# Altium project ALF.PrjPcb
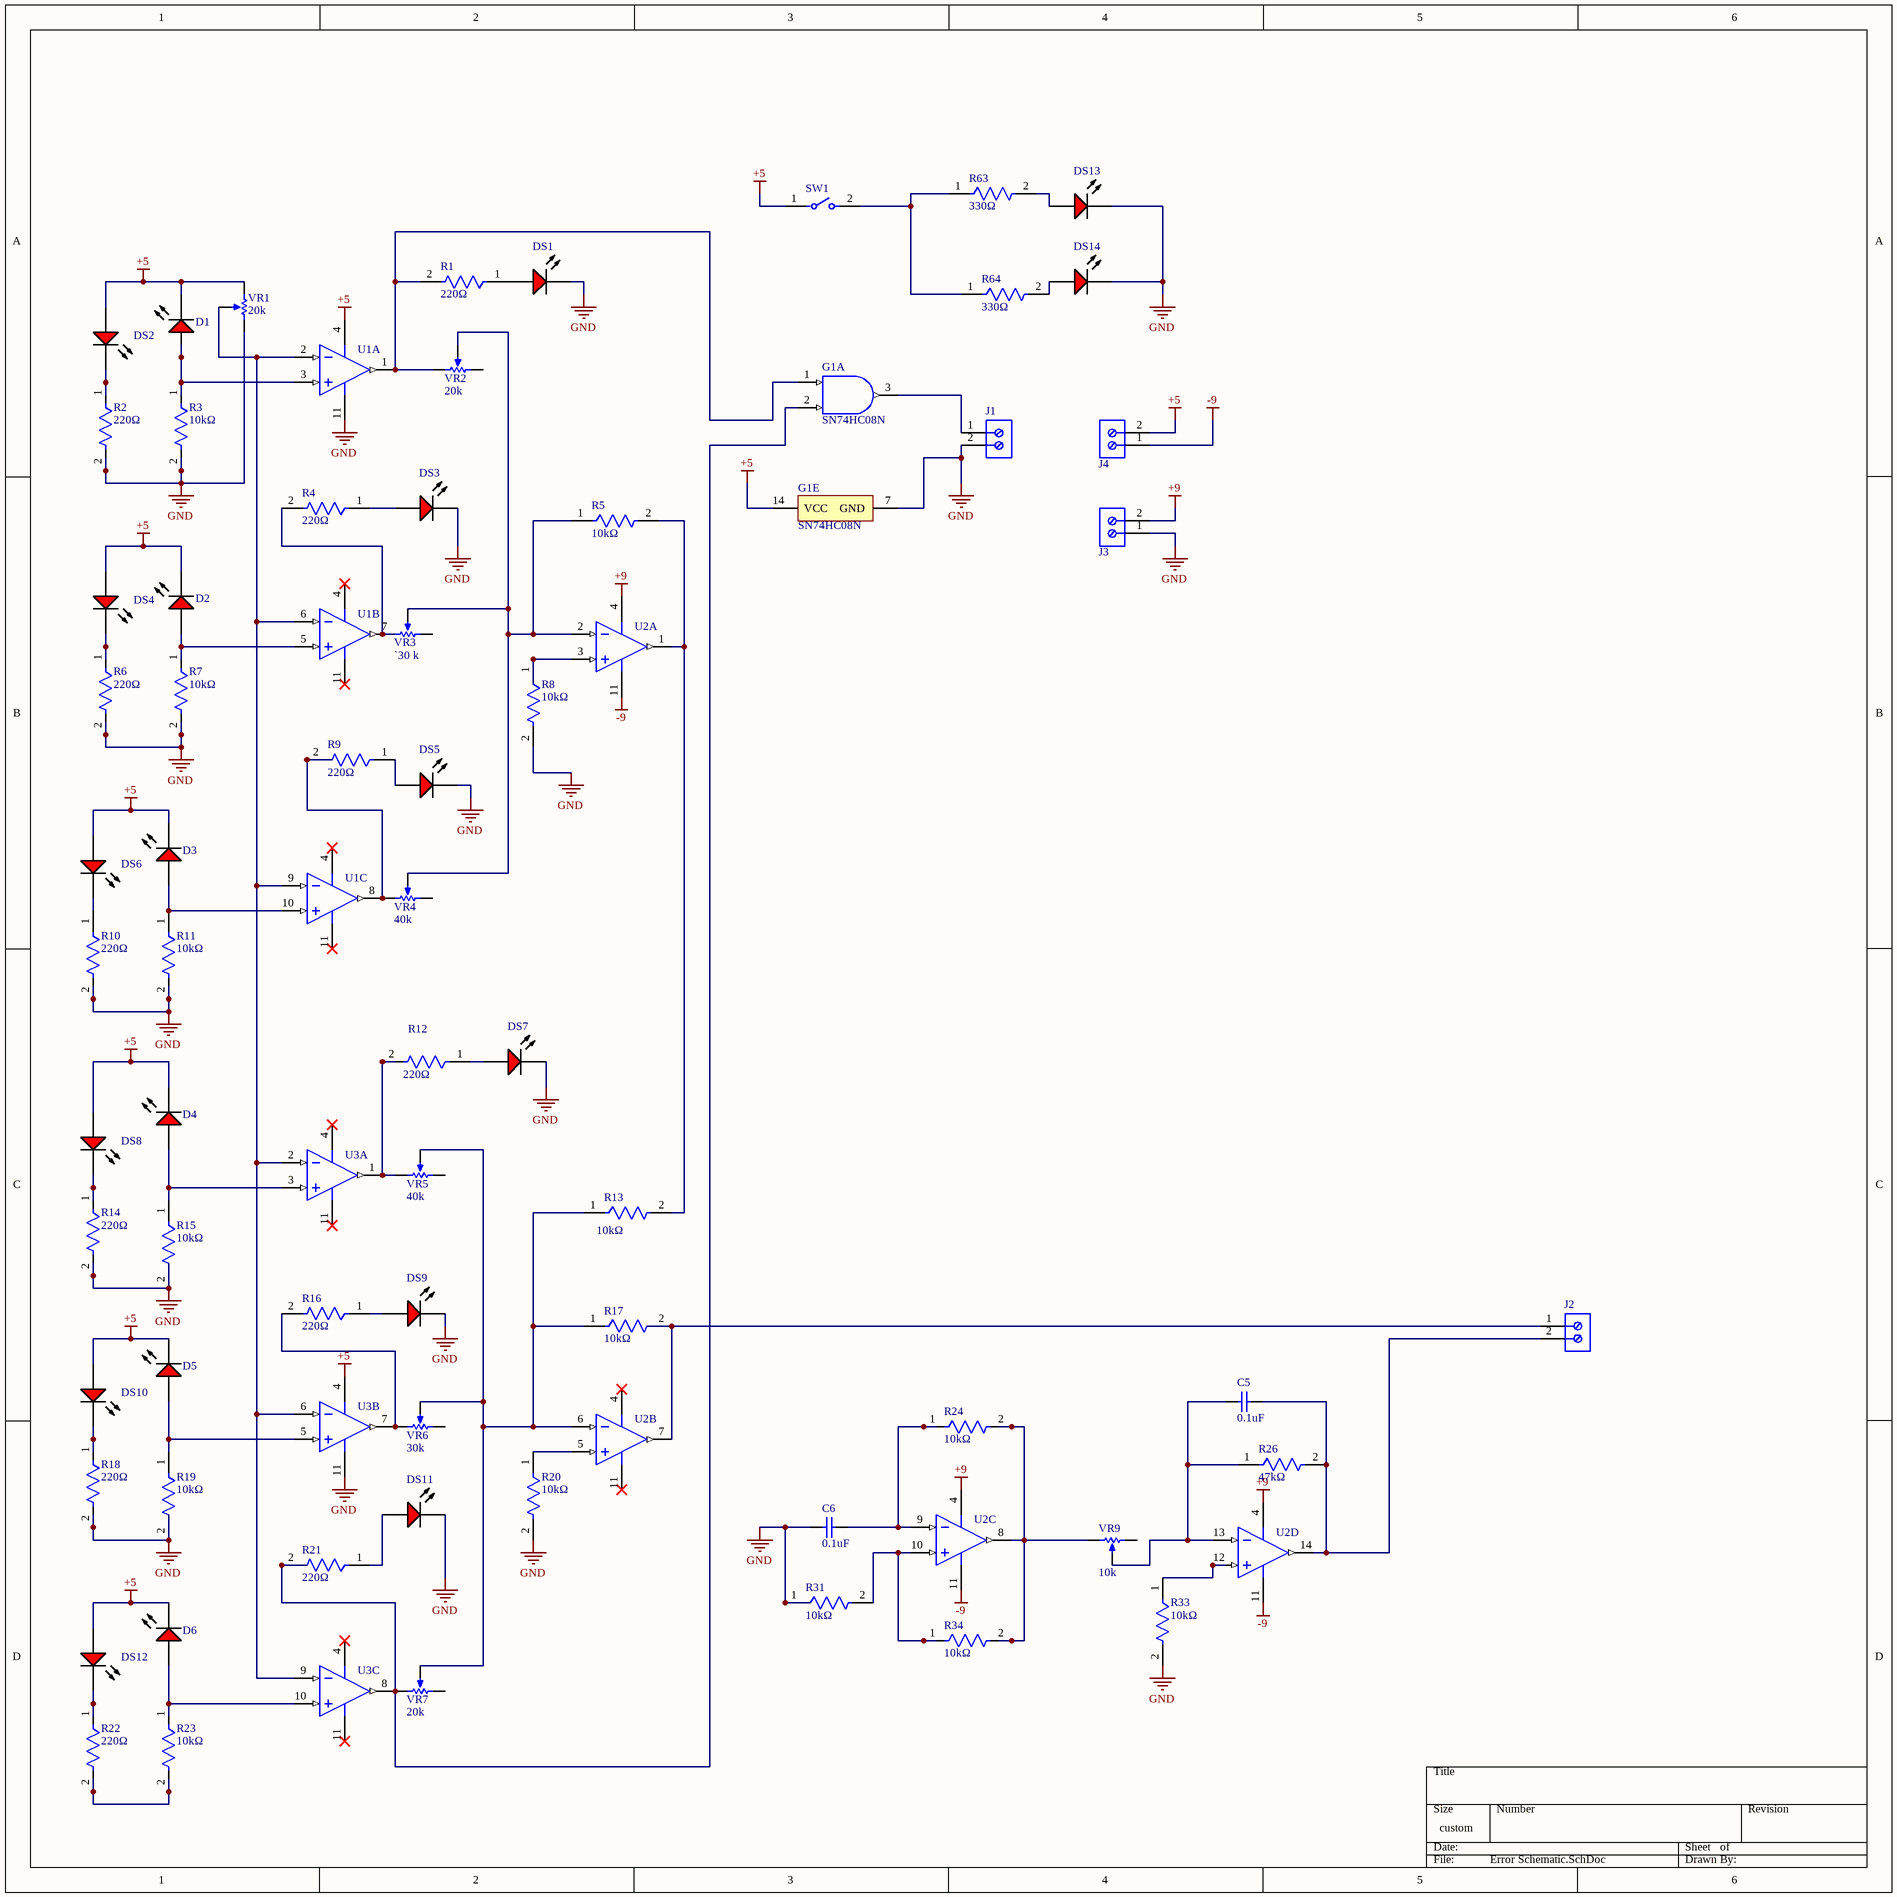
[diagram p0: Error Schematic.SchDoc]
2 sheets, 124 parts. Net scope: global (net labels, ports and power ports of the same name join across sheets).
Board files: ErrorPCB.PcbDoc, PIDPCB.PcbDoc
Sheets:
  Error Schematic.SchDoc
  PID Schematic.SchDoc

## Sheet Error Schematic.SchDoc
size 381 x 381 mm

### Parts
C5  value 0.1uF  [CAPR51-254-508X318X736]  (hidden comment: C320C104K5R5TA)
C6  value 0.1uF  [CAPR51-254-508X318X736]  (hidden comment: C320C104K5R5TA)
D1  HLMP-3301  [AVAG-HLMP-3301-2]  (value not drawn)
D2  HLMP-3301  [AVAG-HLMP-3301-2]  (value not drawn)
D3  HLMP-3301  [AVAG-HLMP-3301-2]  (value not drawn)
D4  HLMP-3301  [AVAG-HLMP-3301-2]  (value not drawn)
D5  HLMP-3301  [AVAG-HLMP-3301-2]  (value not drawn)
D6  HLMP-3301  [AVAG-HLMP-3301-2]  (value not drawn)
DS1  HLMP-3301  [AVAG-HLMP-3301-2]  (value not drawn)
DS2  HLMP-3301  [AVAG-HLMP-3301-2]  (value not drawn)
DS3  HLMP-3301  [AVAG-HLMP-3301-2]  (value not drawn)
DS4  HLMP-3301  [AVAG-HLMP-3301-2]  (value not drawn)
DS5  HLMP-3301  [AVAG-HLMP-3301-2]  (value not drawn)
DS6  HLMP-3301  [AVAG-HLMP-3301-2]  (value not drawn)
DS7  HLMP-3301  [AVAG-HLMP-3301-2]  (value not drawn)
DS8  HLMP-3301  [AVAG-HLMP-3301-2]  (value not drawn)
DS9  HLMP-3301  [AVAG-HLMP-3301-2]  (value not drawn)
DS10  HLMP-3301  [AVAG-HLMP-3301-2]  (value not drawn)
DS11  HLMP-3301  [AVAG-HLMP-3301-2]  (value not drawn)
DS12  HLMP-3301  [AVAG-HLMP-3301-2]  (value not drawn)
DS13  HLMP-3301  [AVAG-HLMP-3301-2]  (value not drawn)
DS14  HLMP-3301  [AVAG-HLMP-3301-2]  (value not drawn)
G1  SN74HC08N  [N0014A]  (parts A,E of 5)
J1  691103110002  [691103110002]  (value not drawn)
J2  691103110002  [691103110002]  (value not drawn)
J3  691103110002  [691103110002]  (value not drawn)
J4  691103110002  [691103110002]  (value not drawn)
R1  Resistance: 220Ω  [FP-MRS25-MFG]  (hidden comment: MRS25000C1101FCT00)
R2  Resistance: 220Ω  [FP-MRS25-MFG]  (hidden comment: MRS25000C1101FCT00)
R3  Resistance: 10kΩ  [FP-MRS25-MFG]  (hidden comment: MRS25000C1101FCT00)
R4  Resistance: 220Ω  [FP-MRS25-MFG]  (hidden comment: MRS25000C1101FCT00)
R5  Resistance: 10kΩ  [FP-MRS25-MFG]  (hidden comment: MRS25000C1101FCT00)
R6  Resistance: 220Ω  [FP-MRS25-MFG]  (hidden comment: MRS25000C1101FCT00)
R7  Resistance: 10kΩ  [FP-MRS25-MFG]  (hidden comment: MRS25000C1101FCT00)
R8  Resistance: 10kΩ  [FP-MRS25-MFG]  (hidden comment: MRS25000C1101FCT00)
R9  Resistance: 220Ω  [FP-MRS25-MFG]  (hidden comment: MRS25000C1101FCT00)
R10  Resistance: 220Ω  [FP-MRS25-MFG]  (hidden comment: MRS25000C1101FCT00)
R11  Resistance: 10kΩ  [FP-MRS25-MFG]  (hidden comment: MRS25000C1101FCT00)
R12  Resistance: 220Ω  [FP-MRS25-MFG]  (hidden comment: MRS25000C1101FCT00)
R13  Resistance: 10kΩ  [FP-MRS25-MFG]  (hidden comment: MRS25000C1101FCT00)
R14  Resistance: 220Ω  [FP-MRS25-MFG]  (hidden comment: MRS25000C1101FCT00)
R15  Resistance: 10kΩ  [FP-MRS25-MFG]  (hidden comment: MRS25000C1101FCT00)
R16  Resistance: 220Ω  [FP-MRS25-MFG]  (hidden comment: MRS25000C1101FCT00)
R17  Resistance: 10kΩ  [FP-MRS25-MFG]  (hidden comment: MRS25000C1101FCT00)
R18  Resistance: 220Ω  [FP-MRS25-MFG]  (hidden comment: MRS25000C1101FCT00)
R19  Resistance: 10kΩ  [FP-MRS25-MFG]  (hidden comment: MRS25000C1101FCT00)
R20  Resistance: 10kΩ  [FP-MRS25-MFG]  (hidden comment: MRS25000C1101FCT00)
R21  Resistance: 220Ω  [FP-MRS25-MFG]  (hidden comment: MRS25000C1101FCT00)
R22  Resistance: 220Ω  [FP-MRS25-MFG]  (hidden comment: MRS25000C1101FCT00)
R23  Resistance: 10kΩ  [FP-MRS25-MFG]  (hidden comment: MRS25000C1101FCT00)
R24  Resistance: 10kΩ  [FP-MRS25-MFG]  (hidden comment: MRS25000C1101FCT00)
R26  Resistance: 47kΩ  [FP-MRS25-MFG]  (hidden comment: MRS25000C1101FCT00)
R31  Resistance: 10kΩ  [FP-MRS25-MFG]  (hidden comment: MRS25000C1101FCT00)
R33  Resistance: 10kΩ  [FP-MRS25-MFG]  (hidden comment: MRS25000C1101FCT00)
R34  Resistance: 10kΩ  [FP-MRS25-MFG]  (hidden comment: MRS25000C1101FCT00)
R63  Resistance: 330Ω  [FP-MRS25-MFG]  (hidden comment: MRS25000C1101FCT00)
R64  Resistance: 330Ω  [FP-MRS25-MFG]  (hidden comment: MRS25000C1101FCT00)
SW1  BD01  [FP-BD01-MFG]  (value not drawn)
U1  LM324N  [N0014A]  (value not drawn)  (parts A,B,C of 4)
U2  LM324N  [N0014A]  (value not drawn)  (parts A,B,C,D of 4)
U3  LM324N  [N0014A]  (value not drawn)  (parts A,B,C of 4)
VR1  Resistance: 20k  [BOUR-3296W]  (hidden comment: 3296W-1-103LF)
VR2  Resistance: 20k  [BOUR-3296W]  (hidden comment: 3296W-1-103LF)
VR3  Resistance: `30 k  [BOUR-3296W]  (hidden comment: 3296W-1-103LF)
VR4  Resistance: 40k  [BOUR-3296W]  (hidden comment: 3296W-1-103LF)
VR5  Resistance: 40k  [BOUR-3296W]  (hidden comment: 3296W-1-103LF)
VR6  Resistance: 30k  [BOUR-3296W]  (hidden comment: 3296W-1-103LF)
VR7  Resistance: 20k  [BOUR-3296W]  (hidden comment: 3296W-1-103LF)
VR9  Resistance: 10k  [BOUR-3296W]  (hidden comment: 3296W-1-103LF)

### Nets
+5: D1.1(K) D2.1(K) D3.1(K) D4.1(K) D5.1(K) D6.1(K) DS2.2(A) DS4.2(A) DS6.2(A) DS8.2(A) DS10.2(A) DS12.2(A) G1.14(VCC) J4.2 SW1.1 U1.4(V+) U3.4(V+) VR1.1(CCW)
+9: J3.2 U2.4(V+)
-9: J4.1 U2.11(GND)
GND: C6.1 DS1.1(K) DS3.1(K) DS5.1(K) DS7.1(K) DS9.1(K) DS11.1(K) DS13.1(K) DS14.1(K) G1.7(GND) J1.2 J3.1 R2.2 R3.2 R6.2 R7.2 R8.2 R10.2 R11.2 R14.2 R15.2 R18.2 R19.2 R20.2 R31.1 R33.2 U1.11(GND) U3.11(GND) VR1.3(CW)
NetC5_1: C5.1 R26.1 U2.13(IN4-) VR9.2(S)
NetC5_2: C5.2 J2.2 R26.2 U2.14(OUT4)
NetC6_2: C6.2 R24.1 U2.9(IN3-)
NetD1_2: D1.2(A) R3.1 U1.3(IN1+)
NetD2_2: D2.2(A) R7.1 U1.5(IN2+)
NetD3_2: D3.2(A) R11.1 U1.10(IN3+)
NetD4_2: D4.2(A) R15.1 U3.3(IN1+)
NetD5_2: D5.2(A) R19.1 U3.5(IN2+)
NetD6_2: D6.2(A) R23.1 U3.10(IN3+)
NetDS1_2: DS1.2(A) R1.1
NetDS2_1: DS2.1(K) R2.1
NetDS3_2: DS3.2(A) R4.1
NetDS4_1: DS4.1(K) R6.1
NetDS5_2: DS5.2(A) R9.1
NetDS6_1: DS6.1(K) R10.1
NetDS7_2: DS7.2(A) R12.1
NetDS8_1: DS8.1(K) R14.1
NetDS9_2: DS9.2(A) R16.1
NetDS10_1: DS10.1(K) R18.1
NetDS11_2: DS11.2(A) R21.1
NetDS12_1: DS12.1(K) R22.1
NetDS13_2: DS13.2(A) R63.2
NetDS14_2: DS14.2(A) R64.2
NetG1_1: G1.1(1A) R1.2 U1.1(OUT1) VR2.3(CW)
NetG1_2: G1.2(1B) R21.2 U3.8(OUT3) VR7.3(CW)
NetG1_3: G1.3(1Y) J1.1
NetJ2_1: J2.1 R17.2 U2.7(OUT2)
NetR4_2: R4.2 U1.7(OUT2) VR3.3(CW)
NetR5_1: R5.1 U2.2(IN1-) VR2.2(S) VR3.2(S) VR4.2(S)
NetR5_2: R5.2 R13.2 U2.1(OUT1)
NetR8_1: R8.1 U2.3(IN1+)
NetR9_2: R9.2 U1.8(OUT3) VR4.3(CW)
NetR12_2: R12.2 U3.1(OUT1) VR5.3(CW)
NetR13_1: R13.1 R17.1 U2.6(IN2-) VR5.2(S) VR6.2(S) VR7.2(S)
NetR16_2: R16.2 U3.7(OUT2) VR6.3(CW)
NetR20_1: R20.1 U2.5(IN2+)
NetR22_2: R22.2 R23.2
NetR24_2: R24.2 R34.2 U2.8(OUT3) VR9.1(CCW)
NetR31_2: R31.2 R34.1 U2.10(IN3+)
NetR33_1: R33.1 U2.12(IN4+)
NetR63_1: R63.1 R64.1 SW1.2
NetU1_2: U1.2(IN1-) U1.6(IN2-) U1.9(IN3-) U3.2(IN1-) U3.6(IN2-) U3.9(IN3-) VR1.2(S)

Not connected (* = marked no-connect by the designer): VR2 1(CCW); VR3 1(CCW); VR4 1(CCW); VR5 1(CCW); VR6 1(CCW); VR7 1(CCW); VR9 3(CW)

### Library data of the parts
C5 C6 = CMP-1664-00004-1: Radial Leaded Multilayer Ceramic Capacitor, 0.1 uF, +/- 10%, 50 V, -55 to 125 degC, 2-Pin THD, RoHS, Tape and Reel; Case\Package: SOT-23-5; Max Power Dissipation: 250 mW; Output Current: 150 mA; Dropout Voltage: 260 mV; Outputs: 1; Output Voltage: 5 V; Max Input Voltage: 8 V; Min Operating Temperature: -40 degC; Packaging: Tape and Reel; Height: 1.3 mm; Radiation Hardening: No; Pins: 5; ComponentLink1Description: Manufacturer URL; Mount: Surface Mount; RoHSCompliant: true; Max Operating Temperature: 85 degC; PackageReference: CAPR51-254-508X318X736; ComponentLink2URL: http://www.kemet.com/docfinder?Partnumber=C320C104K5R5TA; PackageDescription: 2-Pin Through Hole Device, Body 5.08 x 3.18 mm, Pitch 2.54 mm; ComponentLink1URL: http://www.kemet.com/; Width: 1.8 mm; Package Quantity: 3000; DatasheetVersion: Dec-15; Length: 3 mm; ComponentLink2Description: Datasheet
D1-D6 DS1-DS14 = CMP-2000-06411-1: T-1 3/4 (5 mm) Diffused LED Lamp, 1.9 V, -40 to 100 degC, 2-Pin THD, RoHS, Bulk; Manufacturer: Avago; Forward Current: 25mA; Forward Voltage: 2.4V; Peak Wavelength: 635nm; Shape Type: Circular; High Brightness: No; Main Category: StandardLED; Test Current (It): 10mA; Dominant Wave Length: 626nm; Number of  Elements: 1; Reverse Voltage: 5V; Chip Material: GaP; Product Height (mm): 9.19mm; Lens Type: ColoredDiffused; Viewing Angle: 60deg; Type: Uni-Color; Emitting Color: Red; Luminous Intensity: 5.4mcd; Power Dissipation: 85W; DELETED: Compliant; Product Depth (mm): 6.1mm; Package Description: 2-Pin Through Hole LED, Dia 5.85 mm; Mounting Technology: ThroughHole; Manufacturer URL: http://www.avagotech.com/; Package Type: T-13/4; Operating Temp Range: -40Cto100C; Datasheet URL: http://www.avagotech.com/docs/AV02-1558EN; Mounting: ThroughHole; Lens Dimensions: 5.08x5.08x8.3mm; Package Reference: HLMP-3301; Datasheet Version: 03/2015; Pin Count: 2; Packaging: TapeandReel; Operating Temperature Classification: Industrial; Lum Intensity: 5.4mcd; Rad Hardened: No; Product Length (mm): 6.1mm
G1 = CMP-0777-00250-3: Quadruple 2-Input Positive-AND Gates, N0014A, TUBE; Manufacturer: Texas Instruments; Output Type: CMOS; ICC @ Nom Voltage(Max)(mA): 0.02; tpd @ Nom Voltage(Max)(ns): 28; Voltage(Nom)(V): 5; VCC(Min)(V): 2; Technology Family: HC; F @ Nom Voltage(Max)(Mhz): 70; Rating: Catalog; Bits(#): 4; Schmitt Trigger: No; VCC(Max)(V): 6; PackageReference: N0014A; Input Type: CMOS; Generic Part Number: SN74HC08; DatasheetVersion: SCLS081F; Operating Temperature Range(C): -40 to 85
J1-J4 = CMP-1502-03254-1: Series 1031 - 3.50 mm Horizontal Entry Modular with Pressure Clamp WR-TBL, 2 pin; Manufacturer: Wurth Elektronik; Pin Number: 2; Pitch: 3.50mm; Datasheet URL: http://katalog.we-online.de/em/datasheet/6911031100xx.pdf; Package Reference: 691103110002; Publisher: WurthElektronik; Manufacturer URL: http://www.we-online.de; Mounting Technology: THT; Operating Temperature: -40to105degC; Part Number: 691103110002; Packaging: Box
R1-R24 R26 R31 R33 R34 R63 R64 = CMP-02408-000003-1: RES 1.1K OHM 0.6W 1% AXIAL; Manufacturer: Vishay BC Components; Voltage Rating: 350V; Temperature Coefficient: 50ppm/°C; Value: 1.1kΩ; Device Class L1: Passive Components; Height: 2.5mm; Octopart: https://octopart.com/mrs25000c1101fct00-vishay-43740214; Temperature Range Low: -55°C; Temperature: -55°C to +155°C; Temperature Range High: +155°C; Lead Free: Yes; Mouser Description: Thin Film Resistors .6watt 1.1Kohms 1%; Power Rating: 0.6W; Digikey Description: RES 1.1K OHM 0.6W 1% AXIAL; RoHS: TRUE; Tolerance: 1%; Package: MRS25; Device Class L3: Through-Hole Resistors; ComponentLink2URL: http://www.vishay.com/docs/28724/mrs16m25.pdf; ComponentLink2Description: Datasheet; Composition: Thin Film; Automotive: No; Ipc Land Pattern Name: RESAD1000W75L650D250; Device Class L2: Resistors; Category: Res; Series: MRS25; Manufacturer Part Number: MRS25000C1101FCT00
SW1 = CMP-10033-000004-1: SWITCH SLIDE DIP SPST 100MA 5V; Max Voltage Rating (DC): 25V; Contact Current Rating: 25mA; Pitch: 0.1inch; Number of Circuits: 1; Actuator Material: Nylon; Life (Cycles): 10000Cycles; Body Material: PBT; Approvals: UL; Actuator Type: Slide (Standard); Washable: Yes; Actuator Length: 0.9mm; Capacitance: 5pF; Length: 0.18inch; Lead Free: Lead Free; Material: Nylon; Termination: PC Pin; Orientation: Straight; Throw Configuration: SPST; Case/Package: DIP; Package Quantity: 115; Packaging: Rail/Tube; Number of Positions: 1; Max Operating Temperature: 85°C; Terminal Pitch: 2.54mm; Mount: Through Hole; Min Operating Temperature: -40°C; RoHS Compliant: Yes; Depth: 9.65mm; Electrical Life: 10000Cycles; Series: BD; Contact Material: Bronze; Max Current Rating: 100mA; Current Rating: 100mA; Mechanical Life: 10000Cycles; Number of Poles: 1; REACH SVHC: No SVHC; Contact Plating: Gold; Radiation Hardening: No; Width: 9.65mm; Voltage Rating (DC): 5V
U1-U3 = CMP-0055-00082-3: Low Power Quad Operational Amplifier, 14-pin MDIP; Manufacturer: Texas Instruments; CompType: Amplifiers; PowerWise: N; PackageTopMarking: NSUZXYYTTE#*LM324N; PackageDescription: MDIP, .750 x .250 x.130in, 14 Lead, .100in Pitch; Package Reference: N0014A; RoHS: N; Code_JEDEC: MS-001-AA; ComponentLink1URL: http://www.ti.com/general/docs/lit/getliterature.tsp?genericPartNumber=LM324&fileType=pdf; ComponentLink1Description: Datasheet URL; PinCount: 14
VR1-VR7 VR9 = CMP-1747-00001-1: Square Trimpot(R) Trimming Potentiometer, 10 KOhm, +/- 10%, 0.5 W, -55 to 125 degC, 3-Pin THD, RoHS, Tube; Voltage Rating: 75 V; Tolerance: 1%; Power Rating: 100 mW; Case\Package: 0603; Type (Resistor): Thick Film; PackageDescription: 3-Pin Through Hole Device, Body 9.53 x 4.83 mm, Pitch 2.54 mm; RoHSCompliant: true; Package Quantity: 5000; Case Code (Metric): 1608; PackageReference: 3296W; ComponentLink2Description: Datasheet; REACH SVHC: Unknown; Case Code (Imperial): 0603; ComponentLink1URL: http://www.bourns.com/; Width: 0.85 mm; Radiation Hardening: No; Min Operating Temperature: -55 degC; Mount: Surface Mount; ComponentLink1Description: Manufacturer URL; Max Operating Temperature: 155 degC; Weight: 7.1E-05 oz; Pins: 2; DatasheetVersion: May-16; Packaging: Tape and Reel; Height: 0.45 mm; Length: 1.55 mm; ComponentLink2URL: http://www.bourns.com/docs/Product-Datasheets/3296.pdf

## Sheet PID Schematic.SchDoc
size 508 x 304 mm
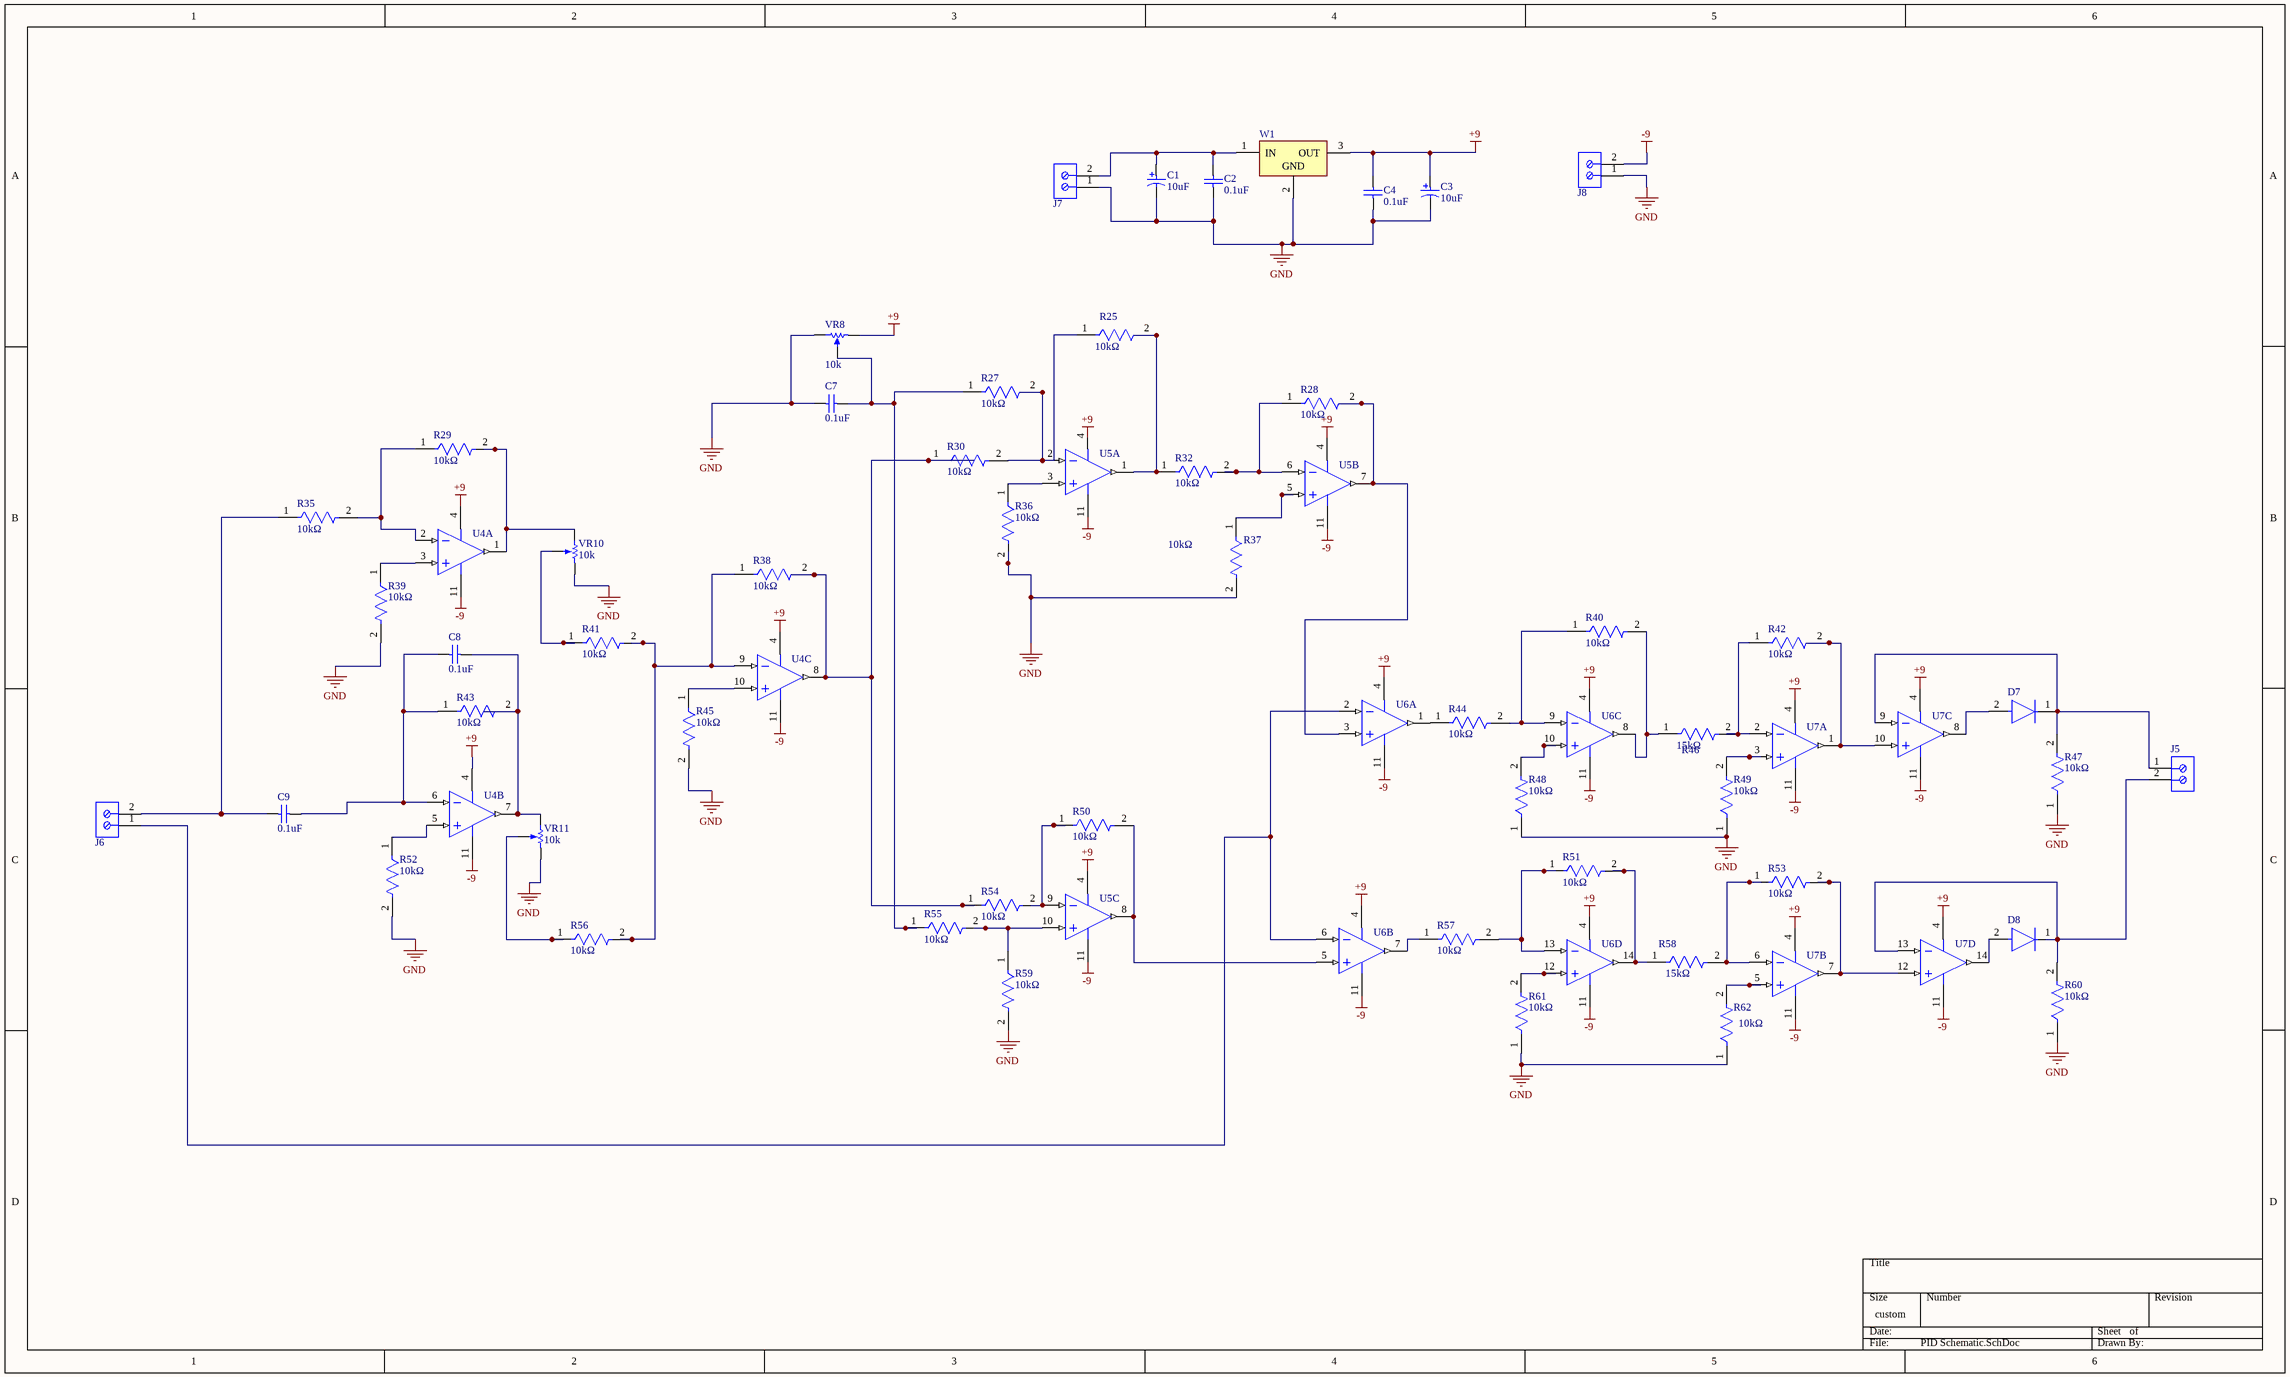
[diagram p1: PID Schematic.SchDoc]

### Parts
C1  Capacitance: 10uF  [CAPPR55-200-1100X500X1200]  (hidden comment: ECA1HM100)
C2  value 0.1uF  [CAPR51-254-508X318X736]  (hidden comment: C320C104K5R5TA)
C3  Capacitance: 10uF  [CAPPR55-200-1100X500X1200]  (hidden comment: ECA1HM100)
C4  value 0.1uF  [CAPR51-254-508X318X736]  (hidden comment: C320C104K5R5TA)
C7  value 0.1uF  [CAPR51-254-508X318X736]  (hidden comment: C320C104K5R5TA)
C8  value 0.1uF  [CAPR51-254-508X318X736]  (hidden comment: C320C104K5R5TA)
C9  value 0.1uF  [CAPR51-254-508X318X736]  (hidden comment: C320C104K5R5TA)
D7  1N4148  [FP-017AG-MFG]  (value not drawn)
D8  1N4148  [FP-017AG-MFG]  (value not drawn)
J5  691103110002  [691103110002]  (value not drawn)
J6  691103110002  [691103110002]  (value not drawn)
J7  691103110002  [691103110002]  (value not drawn)
J8  691103110002  [691103110002]  (value not drawn)
R25  Resistance: 10kΩ  [FP-MRS25-MFG]  (hidden comment: MRS25000C1101FCT00)
R27  Resistance: 10kΩ  [FP-MRS25-MFG]  (hidden comment: MRS25000C1101FCT00)
R28  Resistance: 10kΩ  [FP-MRS25-MFG]  (hidden comment: MRS25000C1101FCT00)
R29  Resistance: 10kΩ  [FP-MRS25-MFG]  (hidden comment: MRS25000C1101FCT00)
R30  Resistance: 10kΩ  [FP-MRS25-MFG]  (hidden comment: MRS25000C1101FCT00)
R32  Resistance: 10kΩ  [FP-MRS25-MFG]  (hidden comment: MRS25000C1101FCT00)
R35  Resistance: 10kΩ  [FP-MRS25-MFG]  (hidden comment: MRS25000C1101FCT00)
R36  Resistance: 10kΩ  [FP-MRS25-MFG]  (hidden comment: MRS25000C1101FCT00)
R37  Resistance: 10kΩ  [FP-MRS25-MFG]  (hidden comment: MRS25000C1101FCT00)
R38  Resistance: 10kΩ  [FP-MRS25-MFG]  (hidden comment: MRS25000C1101FCT00)
R39  Resistance: 10kΩ  [FP-MRS25-MFG]  (hidden comment: MRS25000C1101FCT00)
R40  Resistance: 10kΩ  [FP-MRS25-MFG]  (hidden comment: MRS25000C1101FCT00)
R41  Resistance: 10kΩ  [FP-MRS25-MFG]  (hidden comment: MRS25000C1101FCT00)
R42  Resistance: 10kΩ  [FP-MRS25-MFG]  (hidden comment: MRS25000C1101FCT00)
R43  Resistance: 10kΩ  [FP-MRS25-MFG]  (hidden comment: MRS25000C1101FCT00)
R44  Resistance: 10kΩ  [FP-MRS25-MFG]  (hidden comment: MRS25000C1101FCT00)
R45  Resistance: 10kΩ  [FP-MRS25-MFG]  (hidden comment: MRS25000C1101FCT00)
R46  Resistance: 15kΩ  [FP-MRS25-MFG]  (hidden comment: MRS25000C1101FCT00)
R47  Resistance: 10kΩ  [FP-MRS25-MFG]  (hidden comment: MRS25000C1101FCT00)
R48  Resistance: 10kΩ  [FP-MRS25-MFG]  (hidden comment: MRS25000C1101FCT00)
R49  Resistance: 10kΩ  [FP-MRS25-MFG]  (hidden comment: MRS25000C1101FCT00)
R50  Resistance: 10kΩ  [FP-MRS25-MFG]  (hidden comment: MRS25000C1101FCT00)
R51  Resistance: 10kΩ  [FP-MRS25-MFG]  (hidden comment: MRS25000C1101FCT00)
R52  Resistance: 10kΩ  [FP-MRS25-MFG]  (hidden comment: MRS25000C1101FCT00)
R53  Resistance: 10kΩ  [FP-MRS25-MFG]  (hidden comment: MRS25000C1101FCT00)
R54  Resistance: 10kΩ  [FP-MRS25-MFG]  (hidden comment: MRS25000C1101FCT00)
R55  Resistance: 10kΩ  [FP-MRS25-MFG]  (hidden comment: MRS25000C1101FCT00)
R56  Resistance: 10kΩ  [FP-MRS25-MFG]  (hidden comment: MRS25000C1101FCT00)
R57  Resistance: 10kΩ  [FP-MRS25-MFG]  (hidden comment: MRS25000C1101FCT00)
R58  Resistance: 15kΩ  [FP-MRS25-MFG]  (hidden comment: MRS25000C1101FCT00)
R59  Resistance: 10kΩ  [FP-MRS25-MFG]  (hidden comment: MRS25000C1101FCT00)
R60  Resistance: 10kΩ  [FP-MRS25-MFG]  (hidden comment: MRS25000C1101FCT00)
R61  Resistance: 10kΩ  [FP-MRS25-MFG]  (hidden comment: MRS25000C1101FCT00)
R62  Resistance: 10kΩ  [FP-MRS25-MFG]  (hidden comment: MRS25000C1101FCT00)
U4  LM324N  [N0014A]  (value not drawn)  (parts A,B,C of 4)
U5  LM324N  [N0014A]  (value not drawn)  (parts A,B,C of 4)
U6  LM324N  [N0014A]  (value not drawn)  (parts A,B,C,D of 4)
U7  LM324N  [N0014A]  (value not drawn)  (parts A,B,C,D of 4)
VR8  Resistance: 10k  [BOUR-3296W]  (hidden comment: 3296W-1-103LF)
VR10  Resistance: 10k  [BOUR-3296W]  (hidden comment: 3296W-1-103LF)
VR11  Resistance: 10k  [BOUR-3296W]  (hidden comment: 3296W-1-103LF)
W1  L7809CV  [TO220]  (value not drawn)

### Nets
+9: C3.1 C4.1 U4.4(V+) U5.4(V+) U6.4(V+) U7.4(V+) VR8.3(CW) W1.3(OUT)
-9: J8.2 U4.11(GND) U5.11(GND) U6.11(GND) U7.11(GND)
GND: C1.2 C2.2 C3.2 C4.2 C7.1 J7.1 J8.1 R36.2 R37.2 R39.2 R45.2 R47.1 R48.1 R49.1 R52.2 R59.2 R60.1 R61.1 R62.1 VR8.1(CCW) VR10.3(CW) VR11.3(CW) W1.2(GND)
NetC1_1: C1.1 C2.1 J7.2 W1.1(IN)
NetC7_2: C7.2 R27.1 R55.1 VR8.2(S)
NetC8_1: C8.1 C9.2 R43.1 U4.6(IN2-)
NetC8_2: C8.2 R43.2 U4.7(OUT2) VR11.1(CCW)
NetC9_1: C9.1 J6.2 R35.1
NetD7_1: D7.1(C) J5.1 R47.2 U7.9(IN3-)
NetD7_2: D7.2(A) U7.8(OUT3)
NetD8_1: D8.1(C) J5.2 R60.2 U7.13(IN4-)
NetD8_2: D8.2(A) U7.14(OUT4)
NetJ6_1: J6.1 U6.2(IN1-) U6.6(IN2-)
NetR25_1: R25.1 R27.2 R30.2 U5.2(IN1-)
NetR25_2: R25.2 R32.1 U5.1(OUT1)
NetR28_1: R28.1 R32.2 U5.6(IN2-)
NetR28_2: R28.2 U5.7(OUT2) U6.3(IN1+)
NetR29_1: R29.1 R35.2 U4.2(IN1-)
NetR29_2: R29.2 U4.1(OUT1) VR10.1(CCW)
NetR30_1: R30.1 R38.2 R54.1 U4.8(OUT3)
NetR36_1: R36.1 U5.3(IN1+)
NetR37_1: R37.1 U5.5(IN2+)
NetR38_1: R38.1 R41.2 R56.2 U4.9(IN3-)
NetR39_1: R39.1 U4.3(IN1+)
NetR40_1: R40.1 R44.2 U6.9(IN3-)
NetR40_2: R40.2 R46.1 U6.8(OUT3)
NetR41_1: R41.1 VR10.2(S)
NetR42_1: R42.1 R46.2 U7.2(IN1-)
NetR42_2: R42.2 U7.1(OUT1) U7.10(IN3+)
NetR44_1: R44.1 U6.1(OUT1)
NetR45_1: R45.1 U4.10(IN3+)
NetR48_2: R48.2 U6.10(IN3+)
NetR49_2: R49.2 U7.3(IN1+)
NetR50_1: R50.1 R54.2 U5.9(IN3-)
NetR50_2: R50.2 U5.8(OUT3) U6.5(IN2+)
NetR51_1: R51.1 R57.2 U6.13(IN4-)
NetR51_2: R51.2 R58.1 U6.14(OUT4)
NetR52_1: R52.1 U4.5(IN2+)
NetR53_1: R53.1 R58.2 U7.6(IN2-)
NetR53_2: R53.2 U7.7(OUT2) U7.12(IN4+)
NetR55_2: R55.2 R59.1 U5.10(IN3+)
NetR56_1: R56.1 VR11.2(S)
NetR57_1: R57.1 U6.7(OUT2)
NetR61_2: R61.2 U6.12(IN4+)
NetR62_2: R62.2 U7.5(IN2+)

### Notes on the sheet
- Labels drawn without touching a wire or pin: +9

### Library data of the parts
C1 C3 = CMP-1665-00038-2: Aluminum Electrolytic Capacitor, 10 uF, +/- 20%, 50 V, -40 to 85 degC, 2-Pin THD, RoHS, Bulk; Manufacturer: Panasonic; Life (Hours): 2000Hour; Lead/Base Style: Straight; Dissipation Factor: 0.12%; Leakage Current: 3uA; Dielectric Material: Aluminium; Lead Diameter: 0.5mm; Voltage Rating: 50V; Ripple Current: 65mA; Package Reference: CAPPR55-200-1100X500X1200; Height: 11mm; Diameter: 5mm; REACH SVHC: NoSVHC; Mount: ThroughHole; Packaging: Bulk; Manufacturer URL: http://www.panasonic.com/; Termination: Radial; Datasheet URL: https://industrial.panasonic.com/cdbs/www-data/pdf/RDF0000/ABA0000C1218.pdf; Lead Free: LeadFree; Height - Seated (Max): 0.472inch; Case/Package: Radial; Package Description: 2-Pin Radial Lead, Dia 5 mm, Height 12 mm; Tolerance: 20%; Datasheet Version: Rev. 05, 10/2016; Package Quantity: 200; Ripple Current (AC): 65mA; Min Operating Temperature: -40degC; RoHSCompliant: true; Number of Pins: 2; Max Operating Temperature: 85degC; Voltage: 50V; Lead Pitch: 2mm; Radiation Hardening: No; Voltage Rating (DC): 50V; Length: 11mm
C2 C4 C7-C9 = CMP-1664-00004-1: as C5 on sheet Error Schematic; Min Operating Temperature: -40 degC; Packaging: Tape and Reel; Height: 1.3 mm; Radiation Hardening: No; Pins: 5; ComponentLink1Description: Manufacturer URL; Mount: Surface Mount; RoHSCompliant: true; Max Operating Temperature: 85 degC; PackageReference: CAPR51-254-508X318X736; ComponentLink2URL: http://www.kemet.com/docfinder?Partnumber=C320C104K5R5TA; PackageDescription: 2-Pin Through Hole Device, Body 5.08 x 3.18 mm, Pitch 2.54 mm; ComponentLink1URL: http://www.kemet.com/; Width: 1.8 mm; Package Quantity: 3000; DatasheetVersion: Dec-15; Length: 3 mm; ComponentLink2Description: Datasheet
D7 D8 = CMP-07163-000046-1: DIODE GEN PURP 100V 200MA DO35; Forward Voltage: 1V; Max Power Dissipation: 500mW; Max Reverse Current: 5uA; Forward Current: 300mA; Current: 4A; Reverse Recovery Time: 4ns; Element Configuration: Single; Outside Diameter: 1.85mm; Capacitance: 4pF; Polarity: Standard; Max Forward Surge Current (Ifsm): 1A; Reverse Voltage: 100V; Output Current: 200mA; Average Rectified Current: 200mA; Diameter: 1.91mm; Max Repetitive Reverse Voltage (Vrrm): 100V; Current Rating: 200mA; Case/Package: DO-35; Lead Free: Lead Free; Number of Pins: 2; Recovery Time: 4ns; Packaging: Bulk; Contact Plating: Tin; Voltage: 100V; Mount: Through Hole; Max Surge Current: 4A; Package Quantity: 2000; Width: 1.91mm; Max Reverse Voltage (DC): 100V; Length: 4.56mm; Radiation Hardening: No; Power Dissipation: 500mW; Voltage Rating (DC): 100V; Peak Non-Repetitive Surge Current: 4A; REACH SVHC: No SVHC; Height: 4.56mm; Max Operating Temperature: 175°C; Series: -; Weight: 0.01lb; Min Operating Temperature: -65°C
J5-J8 = CMP-1502-03254-1: as J1 on sheet Error Schematic; Datasheet URL: http://katalog.we-online.de/em/datasheet/6911031100xx.pdf; Package Reference: 691103110002; Publisher: WurthElektronik; Manufacturer URL: http://www.we-online.de; Mounting Technology: THT; Operating Temperature: -40to105degC; Part Number: 691103110002; Packaging: Box
R25 R27-R30 R32 R35-R62 = CMP-02408-000003-1: as R1 on sheet Error Schematic; Device Class L1: Passive Components; Height: 2.5mm; Octopart: https://octopart.com/mrs25000c1101fct00-vishay-43740214; Temperature Range Low: -55°C; Temperature: -55°C to +155°C; Temperature Range High: +155°C; Lead Free: Yes; Mouser Description: Thin Film Resistors .6watt 1.1Kohms 1%; Power Rating: 0.6W; Digikey Description: RES 1.1K OHM 0.6W 1% AXIAL; RoHS: TRUE; Tolerance: 1%; Package: MRS25; Device Class L3: Through-Hole Resistors; ComponentLink2URL: http://www.vishay.com/docs/28724/mrs16m25.pdf; ComponentLink2Description: Datasheet; Composition: Thin Film; Automotive: No; Ipc Land Pattern Name: RESAD1000W75L650D250; Device Class L2: Resistors; Category: Res; Series: MRS25; Manufacturer Part Number: MRS25000C1101FCT00
U4-U7 = CMP-0055-00082-3: as U1 on sheet Error Schematic; PackageDescription: MDIP, .750 x .250 x.130in, 14 Lead, .100in Pitch; Package Reference: N0014A; RoHS: N; Code_JEDEC: MS-001-AA; ComponentLink1URL: http://www.ti.com/general/docs/lit/getliterature.tsp?genericPartNumber=LM324&fileType=pdf; ComponentLink1Description: Datasheet URL; PinCount: 14
VR8 VR10 VR11 = CMP-1747-00001-1: as VR1 on sheet Error Schematic; PackageDescription: 3-Pin Through Hole Device, Body 9.53 x 4.83 mm, Pitch 2.54 mm; RoHSCompliant: true; Package Quantity: 5000; Case Code (Metric): 1608; PackageReference: 3296W; ComponentLink2Description: Datasheet; REACH SVHC: Unknown; Case Code (Imperial): 0603; ComponentLink1URL: http://www.bourns.com/; Width: 0.85 mm; Radiation Hardening: No; Min Operating Temperature: -55 degC; Mount: Surface Mount; ComponentLink1Description: Manufacturer URL; Max Operating Temperature: 155 degC; Weight: 7.1E-05 oz; Pins: 2; DatasheetVersion: May-16; Packaging: Tape and Reel; Height: 0.45 mm; Length: 1.55 mm; ComponentLink2URL: http://www.bourns.com/docs/Product-Datasheets/3296.pdf
W1 = CMP-0244-00459-1: Positive Voltage Regulator, 9V, 3-Pin TO-220; ComponentLink3URL: http://www.st.com/internet/com/TECHNICAL_RESOURCES/TECHNICAL_LITERATURE/PACKAGE_INFORMATION/CD00004649.pdf; ComponentLink2Description: Datasheet; DatasheetVersion: 16/11/2011; PackageVersion: ver3.0; PackageDescription: TO, Thru-Hole, Vertical, Heatsink Mounted; 3 In-Line Leads; Pitch 2.54 mm; ComponentLink3Description: Package Specification; ComponentLink2URL: http://www.st.com/internet/com/TECHNICAL_RESOURCES/TECHNICAL_LITERATURE/DATASHEET/CD00000444.pdf; ComponentLink1URL: http://www.st.com; ComponentLink1Description: Manufacturer URL; PackageReference: TO220

## Nets that join several sheets
+9: Error Schematic (J3.2 U2.4), PID Schematic (8 pins)
-9: Error Schematic (J4.1 U2.11), PID Schematic (5 pins)
GND: Error Schematic (29 pins), PID Schematic (23 pins)